# EasyEDA Pro project ProPrj_Pocket bot_2026-03-04.epro

# Schematic Schematic1
Board Name: Board1; Create Date: 2026-03-03; Page Name: P1; Project Name: Pocket bot; Schematic Name: Schematic1; Update Date: 2026-03-04; Company: EasyEDA.com; Page Size: A4; Version: V1.0
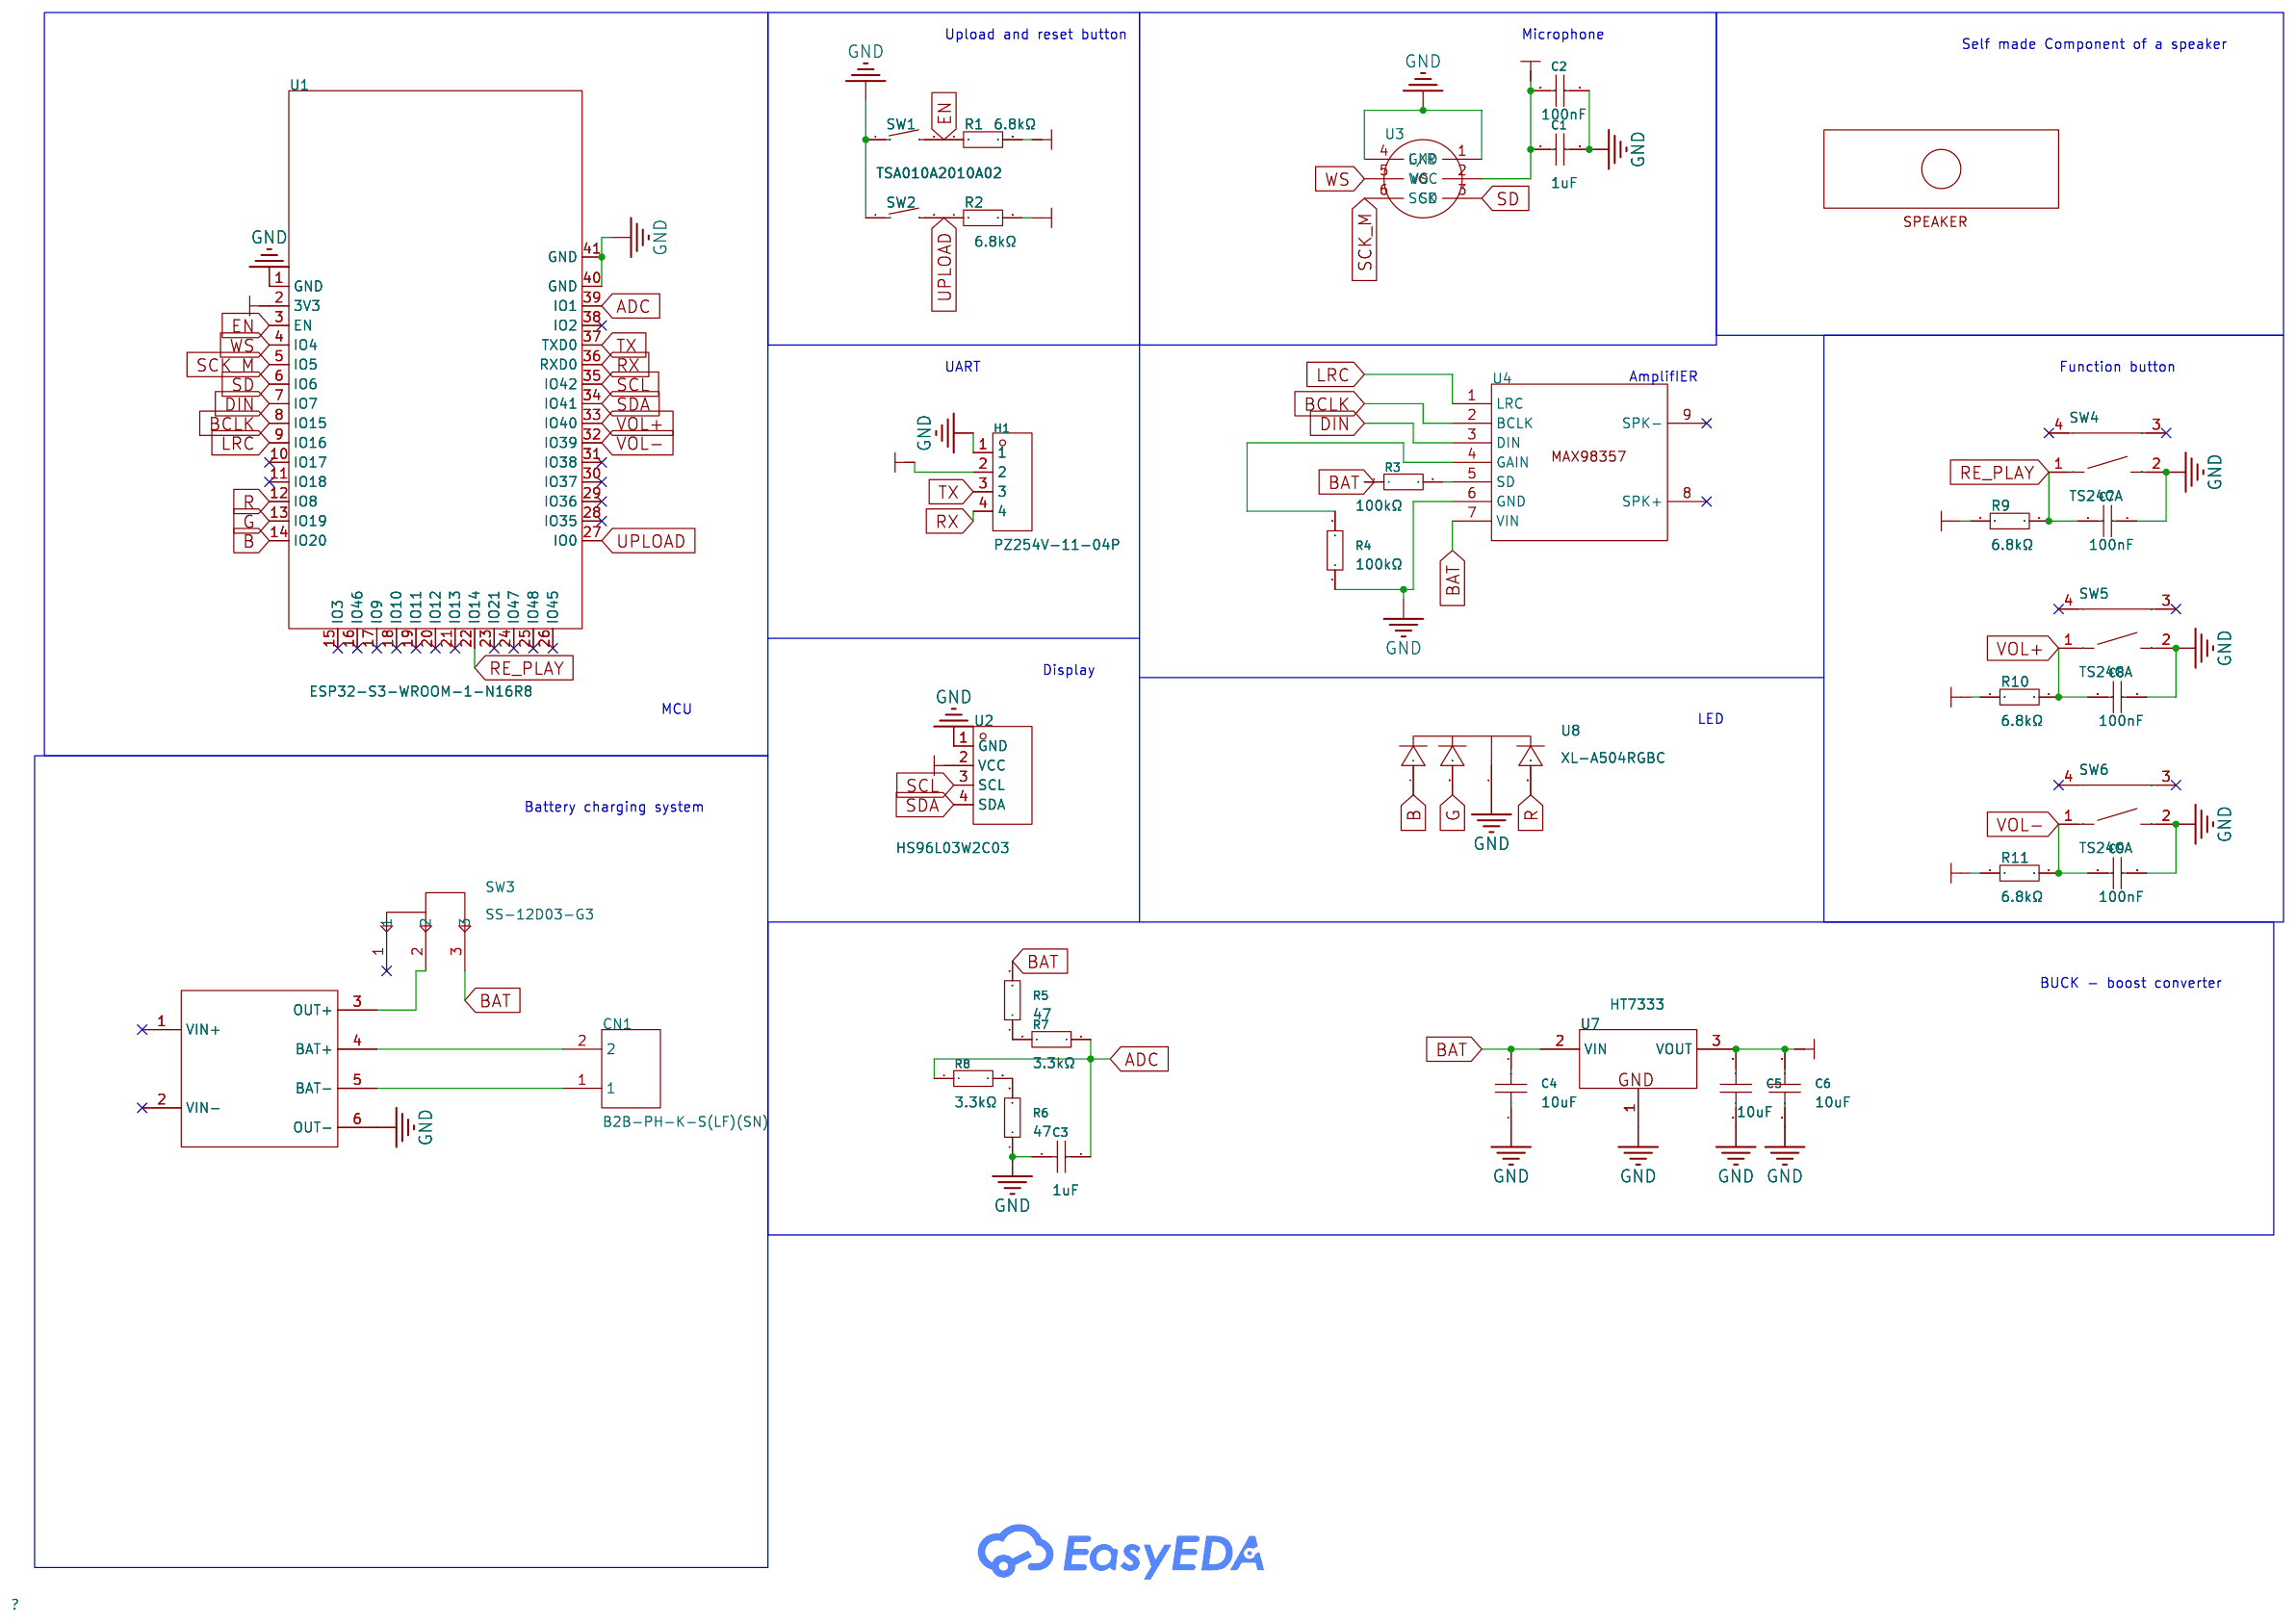
[diagram p0: schematic sheet]

## Parts
C1  1uF  [C0805]
C2  100nF  [C1206]
C3  1uF  [C0805]
C4  10uF  [C0603]
C5  10uF  [C0603]
C6  10uF  [C0603]
C7  100nF  [C1206]
C8  100nF  [C1206]
C9  100nF  [C1206]
CN1  B2B-PH-K-S(LF)(SN)  [CONN-TH_B2B-PH-K-S]
H1  PZ254V-11-04P  [HDR-TH_4P-P2.54-V-M]
R1  6.8kΩ  [R0603]
R2  6.8kΩ  [R0603]
R3  100kΩ  [R0603]
R4  100kΩ  [R0603]
R5  47  [R1206]
R6  47  [R1206]
R7  3.3kΩ  [R0603]
R8  3.3kΩ  [R0603]
R9  6.8kΩ  [R0603]
R10  6.8kΩ  [R0603]
R11  6.8kΩ  [R0603]
SW1  TSA010A2010A02  [KEY-SMD_L3.9-W3.0-LS5.0]
SW2  TSA010A2010A02  [KEY-SMD_L3.9-W3.0-LS5.0]
SW3  SS-12D03-G3  [SW-TH_3P-L8.5-W3.5-P2.50_SS-12D03-G3_C5160828]
SW4  TS24CA  [SW-SMD_2P-TS24CA]
SW5  TS24CA  [SW-SMD_2P-TS24CA]
SW6  TS24CA  [SW-SMD_2P-TS24CA]
U1  ESP32-S3-WROOM-1-N16R8  [WIRELM-SMD_ESP32-S3-WROOM-1]
U2  HS96L03W2C03  [OLED-TH_L27.8-W27.2-P2.54_C9900033791]
U3  -  [INMP441]
U4  -  [MAX98357]
U5  -  [SPEAKER]
U6  -  [TP4056 Carging Module]
U7  HT7333  [SOT-89-3_L4.5-W2.5-P1.50-LS4.1-BR]
U8  XL-A504RGBC  [LED-TH_4P-BD5.8-P1.25_DM-50346EH-73826CC-05RGB-BML60-D]

## Library data of the parts
C1 C3 = CL21B105KBFNNNE: Capacitance:1uF Tolerance:±10% Tolerance:±10% Voltage Rating:50V Temperature Coefficient:X7R; LCSC Part Name: 1uF ±10% 50V; Supplier Part: C28323; Manufacturer: SAMSUNG(三星); Supplier Footprint: 0805; JLCPCB Part Class: Basic Part; Datasheet: https://item.szlcsc.com/datasheet/CL21B105KBFNNNE/29074.html; Supplier: LCSC; Tolerance: ±10%; Voltage Rating: 50V; Temperature Coefficient: X7R
C2 C7-C9 = CL31B104KBCNNNC: Capacitance:100nF Tolerance:±10% Tolerance:±10% Voltage Rating:50V Temperature Coefficient:X7R; LCSC Part Name: 100nF ±10% 50V; Supplier Part: C24497; Manufacturer: SAMSUNG(三星); Supplier Footprint: 1206; JLCPCB Part Class: Basic Part; Datasheet: https://item.szlcsc.com/datasheet/CL31B104KBCNNNC/25237.html; Supplier: LCSC; Tolerance: ±10%; Voltage Rating: 50V; Temperature Coefficient: X7R
C4-C6 = CL10A106MA8NRNC: Capacitance:10uF Tolerance:±20% Tolerance:±20% Voltage Rating:25V Temperature Coefficient:X5R; LCSC Part Name: 10uF ±20% 25V; Supplier Part: C96446; Manufacturer: SAMSUNG(三星); Supplier Footprint: 0603; JLCPCB Part Class: Basic Part; Datasheet: https://item.szlcsc.com/datasheet/CL10A106MA8NRNC/97651.html; Supplier: LCSC; Tolerance: ±20%; Voltage Rating: 25V; Temperature Coefficient: X5R
CN1 = B2B-PH-K-S(LF)(SN): Pins Structure:1x2P Pitch:2mm Mounting Type:Through Hole Reference Series:PH Number of Pins:2P Number of Rows:1 Number of PINs Per Row:2 Row Spacing:- Current Rating:2A Contact Material:Brass Contact Plating:Tin Operating Temperature:-25℃~+85℃ Operating T; LCSC Part Name: 1x2P 间距:2mm 直插 系列:PH; Supplier Part: C131337; Manufacturer: JST; Supplier Footprint: 插件,P=2mm; JLCPCB Part Class: Extended Part; Datasheet: https://item.szlcsc.com/datasheet/B2B-PH-K-S(LF)(SN)/142630.html; Supplier: LCSC; Pins Structure: 1x2P; Pitch: 2mm; Mounting Type: Through Hole; Reference Series: PH; Number of Pins: 2P; Number of Rows: 1; Number of PINs Per Row: 2; Current Rating: 2A; Contact Material: Brass; Contact Plating: Tin; Operating Temperature: -25℃~+85℃; Voltage Rating: 100V; Plastic Material: PA66; Flame Retardant Rating: UL94V-0; Supplementary Features: K Pin; Color: White; Z-Height of the Board: 6mm; X-Length of Bottom Edge on Board (Spacing Line): 5.9mm; Y-Width of Bottom Edge on Board: 4.5mm
H1 = PZ254V-11-04P: Pin Structure:1x4P Pitch:2.54mm Row Spacing:- Circluar Pins/Square Pins:Pin Header Mounting Type:Through Hole Number of Rows:1 Number of Pins:4P Current Rating:3A Voltage Rating (Max):250V Length of Mating Pin:6mm Insulation Height:2.5mm Length of End Con; LCSC Part Name: 1x4P 间距:2.54mm 方针 直插; Supplier Part: C2691448; Manufacturer: XFCN(兴飞); Supplier Footprint: 插件,P=2.54mm; JLCPCB Part Class: Extended Part; Datasheet: https://item.szlcsc.com/datasheet/PZ254V-11-04P/2801085.html; Supplier: LCSC; Pin Structure: 1x4P; Pitch: 2.54mm; Circluar Pins/Square Pins: Pin Header; Mounting Type: Through Hole; Number of Rows: 1; Number of Pins: 4P; Current Rating: 3A; Voltage Rating (Max): 250V; Length of Mating Pin: 6mm; Insulation Height: 2.5mm; Length of End Connection Pin: 3mm; Operating Temperature: -40℃~+105℃; Color: Black
R1 R2 R9-R11 = RC0603FR-071KL: Type:Thick Film Resistor Resistance:1kΩ Tolerance:±1% Tolerance:±1% Power(Watts):100mW Voltage-Supply(Max):75V Temperature Coefficient:±100ppm/℃ Temperature Coefficient:±100ppm/℃ Operating Temperature:-55℃~+155℃ Operating Temperature:-55℃~+155℃; LCSC Part Name: 厚膜电阻 1kΩ ±1% 100mW; Supplier Part: C22548; Manufacturer: YAGEO(国巨); Supplier Footprint: 0603; JLCPCB Part Class: Extended Part; Datasheet: https://item.szlcsc.com/datasheet/RC0603FR-071KL/23274.html; Supplier: LCSC; Type: Thick Film Resistor; Tolerance: ±1%; Power(Watts): 100mW; Voltage-Supply(Max): 75V; Temperature Coefficient: ±100ppm/℃; Operating Temperature: -55℃~+155℃
R3 R4 = RC0603FR-07100KL: Type:Thick Film Resistors Resistance: Tolerance:±1% Tolerance:±1% Power(Watts): Overload Voltage (Max): Temperature Coefficient:±100ppm/℃ Temperature Coefficient:±100ppm/℃ Operating Temperature Range:-55℃~+155℃ Operating Temperature Range:-55℃~+155℃; LCSC Part Name: 厚膜电阻 100kΩ ±1% 100mW; Supplier Part: C14675; Manufacturer: YAGEO(国巨); Supplier Footprint: 0603; JLCPCB Part Class: Extended Part; Datasheet: https://atta.szlcsc.com/upload/public/pdf/source/20140324/1457707028752.pdf; Supplier: LCSC; Type: Thick Film Resistors; Tolerance: ±1%; Temperature Coefficient: ±100ppm/℃; Operating Temperature Range: -55℃~+155℃
R5 R6 = 1206W4F100KT5E: Type:Thick Film Resistor Resistance:1Ω Tolerance:±1% Tolerance:±1% Power(Watts):250mW Voltage-Supply(Max):200V Temperature Coefficient:±200ppm/℃ Temperature Coefficient:±200ppm/℃ Operating Temperature:-55℃~+155℃ Operating Temperature:-55℃~+155℃; LCSC Part Name: 1Ω ±1% 250mW 厚膜电阻; Supplier Part: C17928; Manufacturer: UNI-ROYAL(厚声); Supplier Footprint: 1206; JLCPCB Part Class: Basic Part; Datasheet: https://item.szlcsc.com/datasheet/1206W4F100KT5E/18616.html; Supplier: LCSC; Type: Thick Film Resistor; Tolerance: ±1%; Power(Watts): 250mW; Voltage-Supply(Max): 200V; Temperature Coefficient: ±200ppm/℃; Operating Temperature: -55℃~+155℃
R7 R8 = 0603WAF3301T5E: Type:Thick Film Resistor Resistance:3.3kΩ Tolerance:±1% Tolerance:±1% Power(Watts):100mW Voltage-Supply(Max):75V Temperature Coefficient:±100ppm/℃ Temperature Coefficient:±100ppm/℃ Operating Temperature:-55℃~+155℃ Operating Temperature:-55℃~+155℃; LCSC Part Name: 3.3kΩ ±1% 100mW 厚膜电阻; Supplier Part: C22978; Manufacturer: UNI-ROYAL(厚声); Supplier Footprint: 0603; JLCPCB Part Class: Basic Part; Datasheet: https://item.szlcsc.com/datasheet/0603WAF3301T5E/23705.html; Supplier: LCSC; Type: Thick Film Resistor; Tolerance: ±1%; Power(Watts): 100mW; Voltage-Supply(Max): 75V; Temperature Coefficient: ±100ppm/℃; Operating Temperature: -55℃~+155℃
SW1 SW2 = TSA010A2010A02: Actuator Style:Round Button Operating Force:1N Mounting Type:Surface Mount,Vertical Length:3.9mm Width:3mm Switch Height:2mm Contact Current:50mA Voltage Rating:12V Life:-; LCSC Part Name: 3*4*2.0H-J 100gf 单弹平脚; Supplier Part: C2888943; Manufacturer: BZCN(博众电气); Supplier Footprint: SMD,3.9x3mm; JLCPCB Part Class: Extended Part; Datasheet: https://item.szlcsc.com/datasheet/TSA010A2010A02/3109346.html; Supplier: LCSC; Actuator Style: Round Button; Operating Force: 1N; Mounting Type: Surface Mount,Vertical; Length: 3.9mm; Width: 3mm; Switch Height: 2mm; Contact Current: 50mA; Voltage Rating: 12V
SW3 = SS-12D03-G3_C5160828: Supplier Part: C5160828; Manufacturer: DEALON(德艺隆); Supplier Footprint: 插件; JLCPCB Part Class: Extended Part; Datasheet: https://atta.szlcsc.com/upload/public/pdf/source/20220914/46967EFD64D75927271155BD7ED48D9B.pdf; Supplier: LCSC
SW4-SW6 = TS24CA: Circuit:SPST Actuator Style:Rectangular Button Mounting Type:Surface Mount, Right Angle Length:4.55mm Width:1.8mm Switch Height:3.5mm Contact Current:50mA Voltage Rating:12V With Lamp:- Life:-; LCSC Part Name: 4.55*1.8*3.5mm 卧贴 轻触开关; Supplier Part: C393942; Manufacturer: SHOU HAN(首韩); Supplier Footprint: SMD,4.6x1.8mm; JLCPCB Part Class: Extended Part; Datasheet: https://item.szlcsc.com/datasheet/TS24CA/372554.html; Supplier: LCSC; Circuit: SPST; Actuator Style: Rectangular Button; Mounting Type: Surface Mount, Right Angle; Length: 4.55mm; Width: 1.8mm; Switch Height: 3.5mm; Contact Current: 50mA; Voltage Rating: 12V
U1 = ESP32-S3-WROOM-1-N16R8: LCSC Part Name: 通用型Wi-Fi+低功耗蓝牙MCU模组; Supplier Part: C2913202; Manufacturer: ESPRESSIF(乐鑫); Supplier Footprint: SMD,25.5x18mm; JLCPCB Part Class: Extended Part; Datasheet: https://item.szlcsc.com/datasheet/ESP32-S3-WROOM-1-N16R8/3198300.html; Supplier: LCSC
U2 = HS96L03W2C03: Controller Type:SSD1315 chip Interface:I2C Size:0.96 Dot Pixels:128x64 Operating Temperature:-40℃~+70℃ Operating Temperature:-40℃~+70℃ Type of Drive:Passive (PMOLED) Display Range:21.744x10.864mm Display Color:White Voltage - Supply:2.8V~3.3V Voltage - Su; LCSC Part Name: 0.96寸OLED显示屏窄白光IIC; Supplier Part: C5248080; Manufacturer: HS(汉昇); JLCPCB Part Class: Extended Part; Datasheet: https://item.szlcsc.com/datasheet/HS96L03W2C03/5960631.html; Supplier: LCSC; Controller Type: SSD1315 chip; Interface: I2C; Size: 0.96; Dot Pixels: 128x64; Operating Temperature: -40℃~+70℃; Type of Drive: Passive (PMOLED); Display Range: 21.744x10.864mm; Display Color: White; Voltage - Supply: 2.8V~3.3V; Luminance: 180cd/m2
U3 = INMP441
U4 = MAX98357
U5 = SPEAKER
U6 = TP4056 Charging Module
U7 = HT7333: Output Type:-; Supplier Part: C259241; Supplier Footprint: SOT-89-3; JLCPCB Part Class: Extended Part; Supplier: LCSC
U8 = XL-A504RGBC: Diode Configuration:Common Cathode Lens Color:Colorless Transparent Lens Operating Temperature:-30℃~+85℃ Operating Temperature:-30℃~+85℃; Supplier Part: C7371894; Manufacturer: XINGLIGHT(成兴光); Supplier Footprint: 插件,D=5mm; JLCPCB Part Class: Extended Part; Datasheet: https://item.szlcsc.com/datasheet/XL-A504RGBC/8342966.html; Supplier: LCSC; Diode Configuration: Common Cathode; Lens Color: Colorless Transparent Lens; Operating Temperature: -30℃~+85℃

## Nets
+3V3: C1.1 C2.1 C5.2 C6.2 H1.2 R1.2 R2.2 R9.2 R10.2 R11.2 U1.2(3V3) U2.2(VCC) U3.2(VCC) U7.3(VOUT)
GND: C1.2 C2.2 C3.1 C4.1 C5.1 C6.1 C7.2 C8.2 C9.2 H1.1 R4.1 R6.1 SW1.1 SW2.1 SW4.2 SW5.2 SW6.2 U1.1(GND) U1.40(GND) U1.41(GND) U2.1(GND) U3.1(GND) U3.4(L/R) U4.6(GND) U6.6(OUT-) U7.1(GND) U8.1(-)
ADC: C3.2 R7.2 R8.1 U1.39(IO1)
B: U1.14(IO20) U8.4
BAT: C4.2 R3.1 R5.2 SW3.3 U4.7(VIN) U7.2(VIN)
BCLK: U1.8(IO15) U4.2(BCLK)
DIN: U1.7(IO7) U4.3(DIN)
EN: R1.1 SW1.2 U1.3(EN)
G: U1.13(IO19) U8.3
LRC: U1.9(IO16) U4.1(LRC)
R: U1.12(IO8) U8.2
RE_PLAY: C7.1 R9.1 SW4.1 U1.22(IO14)
RX: H1.4 U1.36(RXD0)
SCK_M: U1.5(IO5) U3.6(SCK)
SCL: U1.35(IO42) U2.3(SCL)
SD: U1.6(IO6) U3.3(SD)
SDA: U1.34(IO41) U2.4(SDA)
TX: H1.3 U1.37(TXD0)
UPLOAD: R2.1 SW2.2 U1.27(IO0)
VOL+: C8.1 R10.1 SW5.1 U1.33(IO40)
VOL-: C9.1 R11.1 SW6.1 U1.32(IO39)
WS: U1.4(IO4) U3.5(WS)
$1N2533: R3.2 U4.5(SD)
$1N2537: R4.2 U4.4(GAIN)
$1N4097: SW3.2 U6.3(OUT+)
$1N4270: CN1.2 U6.4(BAT+)
$1N4274: CN1.1 U6.5(BAT-)
$1N4477: R5.1 R7.1
$1N4516: R6.2 R8.2

Not connected (* = marked no-connect by the designer): SW3 1*; SW4 3* 4*; SW5 3* 4*; SW6 3* 4*; U1 10(IO17)* 11(IO18)* 15(IO3)* 16(IO46)* 17(IO9)* 18(IO10)* 19(IO11)* 20(IO12)* 21(IO13)* 23(IO21)* 24(IO47)* 25(IO48)* 26(IO45)* 28(IO35)* 29(IO36)* 30(IO37)* 31(IO38)* 38(IO2)*; U4 8(SPK+)* 9(SPK-)*; U6 1(VIN+)* 2(VIN-)*

## Notes on the sheet
- Upload and reset button
- Microphone
- Self made Component of a speaker
- UART
- AmplifIER
- Function button
- Display
- MCU
- LED
- Battery charging system
- BUCK - boost converter

# Board PCB1
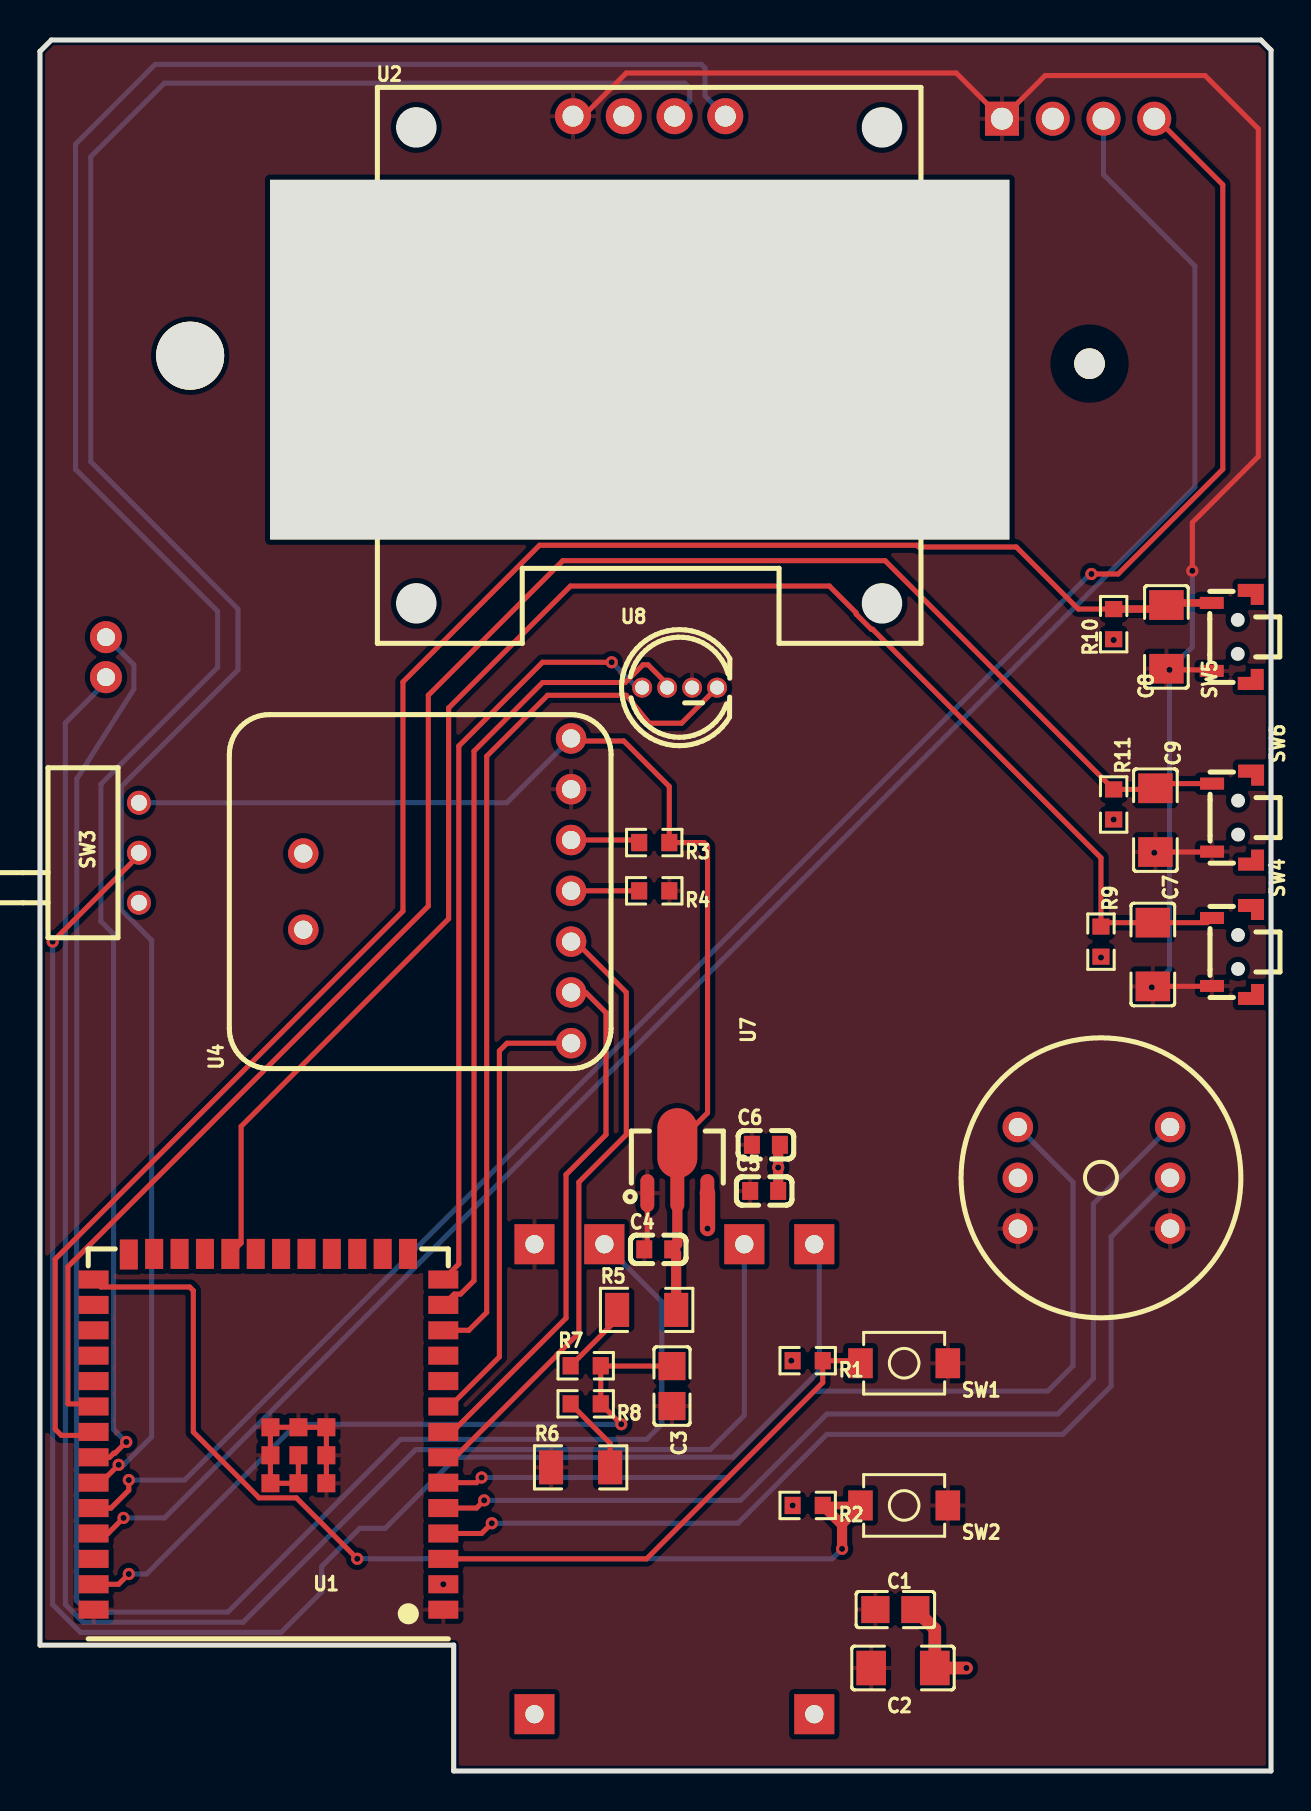
[diagram p1: board, top side]
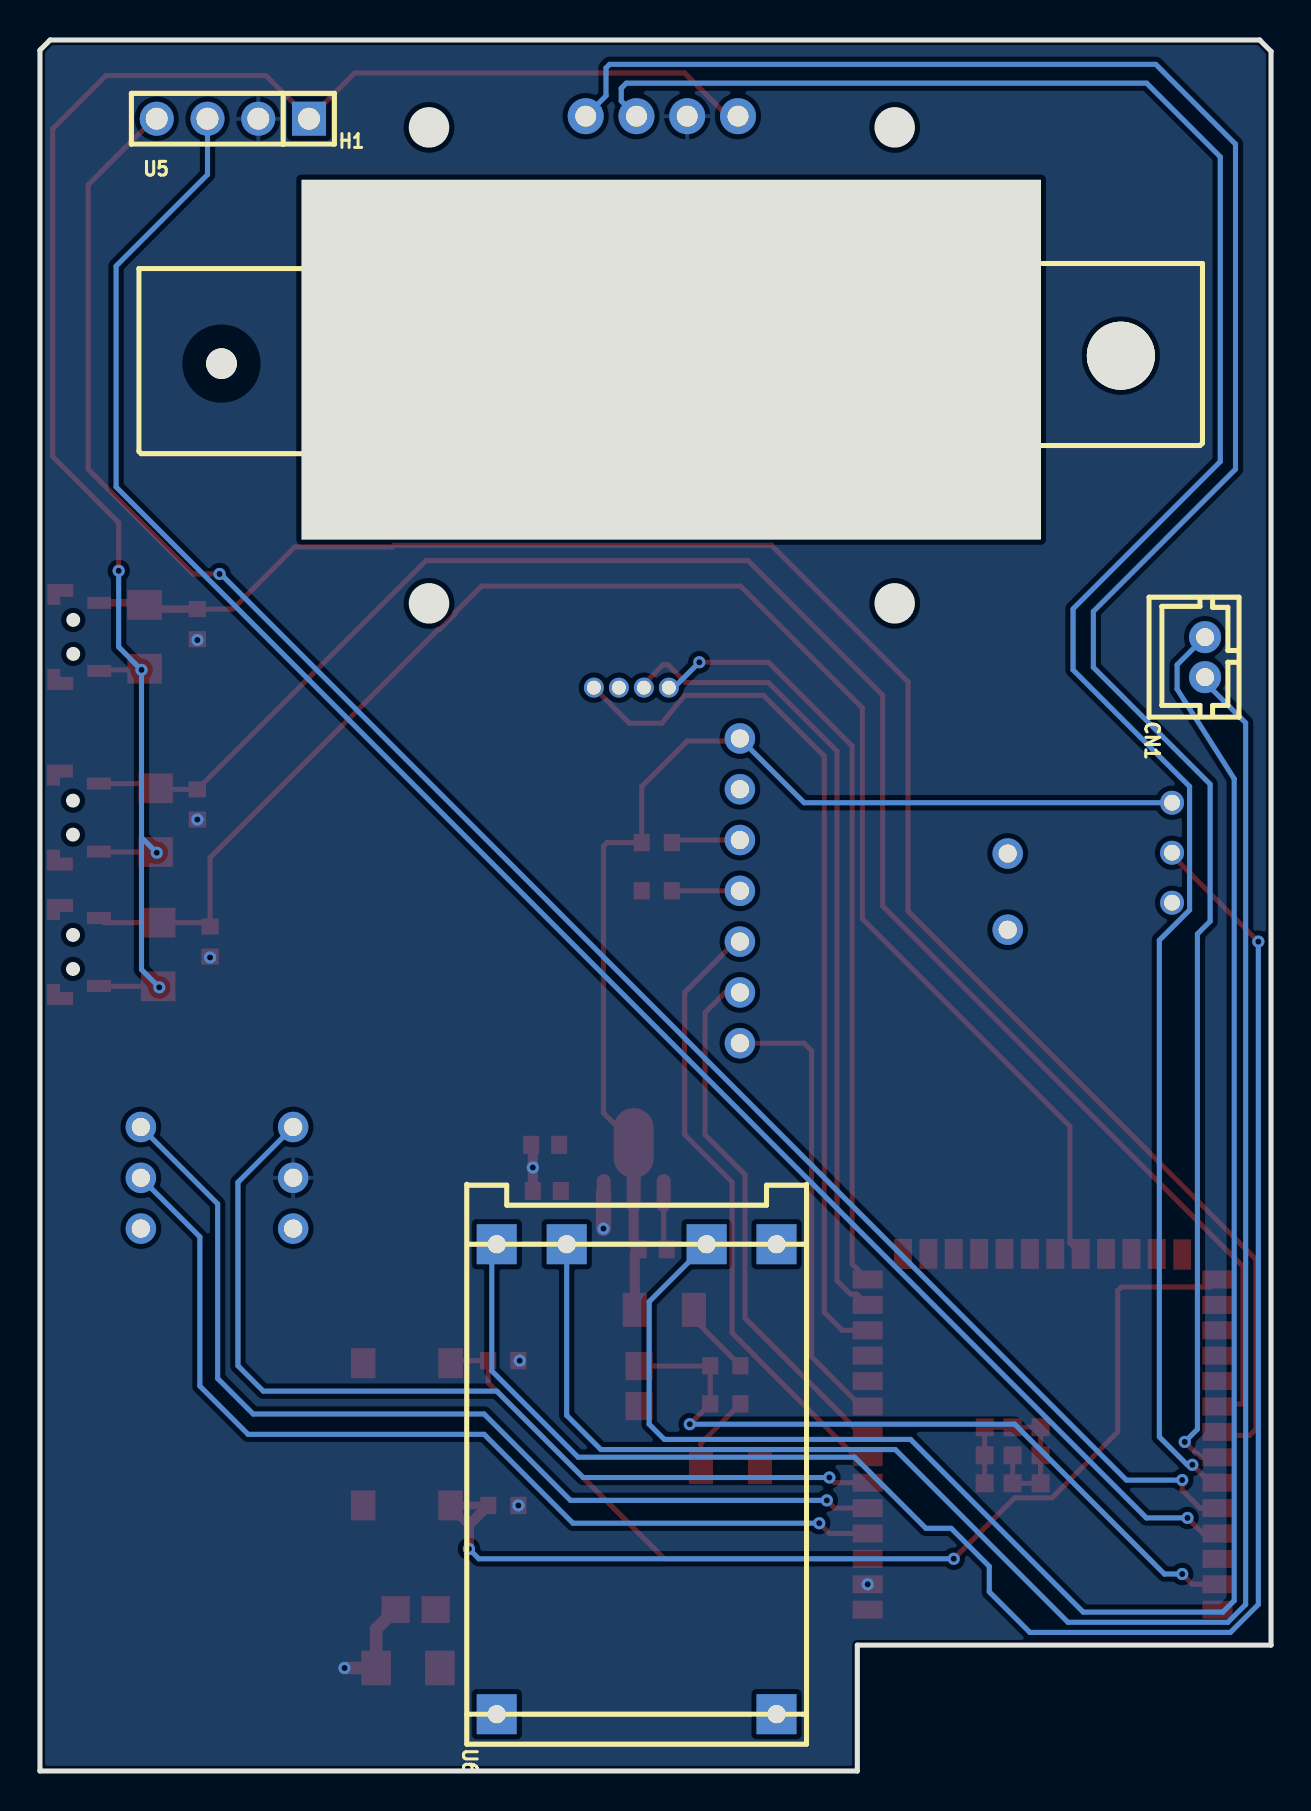
[diagram p2: board, bottom side, seen from below]

Outline 61.59 x 86.56 mm; copper layers: Top Layer, Bottom Layer. Coordinates in mm from the lower left corner of the outline.
Outline path: 0,85.99 0.57,86.56 61.09,86.56 61.59,86.05 61.59,0 20.7,0 20.7,6.29 0,6.29 0,85.99
Stack: Top Layer 0.035mm / Dielectric1 1.51mm FR4 er 4.5 / Bottom Layer 0.035mm

## Design rules (mm)
template: JLCPCB Capability(Two Layers Board)
spacing copperThickness1oz (default): track to track 0.102, other pairs 0.152 to 0.3
spacing copperThickness2oz: track to track 0.203, other pairs 0.152 to 0.3
track width copperThickness1oz (default): min 0.127, default 0.254, max 2.54
track width copperThickness2oz: min 0.203, default 0.254, max 2.54
differential pair differentialPair (default): width min 0.127, default 0.254, max 2.54; gap min 0.152, default 0.152
via viaSize (default): diameter min 0.5, default 0.61, max 10; hole min 0.3, default 0.305, max 6.3

## Placement (name value [footprint] x y rotation side)
C1  1uF  [C0805]  42.8 8.07 180 top
C2  100nF  [C1206]  43.18 5.15 180 top
C3  1uF  [C0805]  31.62 19.25 90 top
C4  10uF  [C0603]  30.93 26.08 0 top
C5  10uF  [C0603]  36.24 29 0 top
C6  10uF  [C0603]  36.32 31.31 0 top
C7  100nF  [C1206]  55.68 40.83 270 top
C8  100nF  [C1206]  56.36 56.71 270 top
C9  100nF  [C1206]  55.81 47.55 270 top
CN1  B2B-PH-K-S(LF)(SN)  [CONN-TH_B2B-PH-K-S]  3.3 55.7 90 bottom
H1  PZ254V-11-04P  [HDR-TH_4P-P2.54-V-M]  51.94 82.62 0 bottom
R1  6.8kΩ  [R0603]  38.41 20.52 180 top
R2  6.8kΩ  [R0603]  38.41 13.28 180 top
R3  100kΩ  [R0603]  30.73 46.43 180 top
R4  100kΩ  [R0603]  30.73 44.01 180 top
R5  47  [R1206]  30.35 23.06 0 top
R6  47  [R1206]  27.05 15.18 0 top
R7  3.3kΩ  [R0603]  27.31 20.26 0 top
R8  3.3kΩ  [R0603]  27.31 18.36 180 top
R9  6.8kΩ  [R0603]  53.09 41.47 270 top
R10  6.8kΩ  [R0603]  53.72 57.35 270 top
R11  6.8kΩ  [R0603]  53.72 48.33 270 top
SW1  TSA010A2010A02  [KEY-SMD_L3.9-W3.0-LS5.0]  43.24 20.39 180 top
SW2  TSA010A2010A02  [KEY-SMD_L3.9-W3.0-LS5.0]  43.24 13.28 180 top
SW3  SS-12D03-G3  [SW-TH_3P-L8.5-W3.5-P2.50_SS-12D03-G3_C5160828]  4.95 45.92 90 top
SW4  TS24CA  [SW-SMD_2P-TS24CA]  59.62 40.96 270 top
SW5  TS24CA  [SW-SMD_2P-TS24CA]  59.6 56.71 270 top
SW6  TS24CA  [SW-SMD_2P-TS24CA]  59.62 47.67 270 top
U1  ESP32-S3-WROOM-1-N16R8  [WIRELM-SMD_ESP32-S3-WROOM-1]  11.43 16.96 180 top
U2  HS96L03W2C03  [OLED-TH_L27.8-W27.2-P2.54_C9900033791]  30.48 82.75 0 top
U3  -  [INMP441]  53.09 29.66 90 top
U4  -  [MAX98357]  28.57 35.12 90 top
U5  -  [SPEAKER]  55.75 60.65 180 bottom
U6  -  [TP4056 Carging Module]  23.24 1.34 90 bottom
U7  HT7333  [SOT-89-3_L4.5-W2.5-P1.50-LS4.1-BR]  31.89 30.15 270 top
U8  XL-A504RGBC  [LED-TH_4P-BD5.8-P1.25_DM-50346EH-73826CC-05RGB-BML60-D]  32 54.17 0 top

## Footprints (pads in the part's own frame, mm; a bottom-side part is the same pattern mirrored in y, then rotated)
C0603
  rect 0.8x0.9 smd: 1(-0.7,0) 2(0.7,0)
C0805
  rect 1.41x1.35 smd: 1(-1,0) 2(1,0)
C1206
  rect 1.485x1.728 smd: 1(-1.593,0) 2(1.593,0)
CONN-TH_B2B-PH-K-S
  round 1.6 hole 0.9: 1(1,0) 2(-1,0)
HDR-TH_4P-P2.54-V-M
  rect 1.7x1.7 hole 1.1: 1(-3.81,0)
  round 1.7 hole 1.1: 2(-1.27,0) 3(1.27,0) 4(3.81,0)
INMP441
  round 1.524 hole 0.914: 1(-2.54,4.159) 2(0,4.159) 3(2.54,4.159) 4(-2.54,-3.461) 5(0,-3.461) 6(2.54,-3.461)
KEY-SMD_L3.9-W3.0-LS5.0
  rect 1.23x1.5 smd: 1(-2.185,0) 2(2.185,0)
LED-TH_4P-BD5.8-P1.25_DM-50346EH-73826CC-05RGB-BML60-D
  round 1 hole 0.7: 1(0.625,0) 2(1.875,0) 3(-0.625,0) 4(-1.875,0)
MAX98357
  round 1.524 hole 0.914: 1(1.27,2) 2(3.81,2) 3(6.35,2) 4(8.89,2) 5(11.43,2) 6(13.97,2) 7(16.51,2) 8(10.755,15.4) 9(6.945,15.4)
OLED-TH_L27.8-W27.2-P2.54_C9900033791
  round 1.8 hole 1.05: 1(-3.81,0) 2(-1.27,0) 3(1.27,0) 4(3.81,0)
R0603
  rect 0.806x0.864 smd: 1(-0.753,0) 2(0.753,0)
R1206
  rect 1.208x1.701 smd: 1(-1.479,0) 2(1.479,0)
SOT-89-3_L4.5-W2.5-P1.50-LS4.1-BR
  oval 1.9x0.7 smd: 1(1.25,-1.501) 3(1.25,1.501)
  oval 3.5x2 smd: 2(-1.25,0)
  oval 2.1x0.7 smd: 2(1.151,0)
SPEAKER
  round 1.524 hole 3.4: 1(3.24,9.724)
  round 3.4 hole 3.4: 2(48.238,10.122)
SW-SMD_2P-TS24CA
  rect 0.6x1.2 smd: 1(-1.7,-0.975) 2(1.7,-0.975)
  custom 1.05x1.3 smd: 3(2.125,0.975) 4(-2.125,0.975)
SW-TH_3P-L8.5-W3.5-P2.50_SS-12D03-G3_C5160828
  round 1.2 hole 0.8: 1(-2.5,0) 2(0,0) 3(2.5,0)
TP4056 Carging Module
  rect 2x2 hole 0.914: 1(1.5,15.5) 2(1.5,1.5) 3(25,15.5) 4(25,12) 5(25,5) 6(25,1.5)
WIRELM-SMD_ESP32-S3-WROOM-1
  rect 1.5x0.9 smd: 1(-8.75,8.895) 2(-8.75,7.625) 3(-8.75,6.355) 4(-8.75,5.085) 5(-8.75,3.815) 6(-8.75,2.545) 7(-8.75,1.275) 8(-8.75,0.005) 9(-8.75,-1.265) 10(-8.75,-2.535) 11(-8.75,-3.805) 12(-8.75,-5.075) 13(-8.75,-6.345) 14(-8.75,-7.615) 27(8.75,-7.615) 28(8.75,-6.345) 29(8.75,-5.075) 30(8.75,-3.805) 31(8.75,-2.535) 32(8.75,-1.265) 33(8.75,0.005) 34(8.75,1.275) 35(8.75,2.545) 36(8.75,3.815) 37(8.75,5.085) 38(8.75,6.355) 39(8.75,7.625) 40(8.75,8.895)
  rect 0.9x1.5 smd: 15(-6.985,-8.895) 16(-5.715,-8.895) 17(-4.445,-8.895) 18(-3.175,-8.895) 19(-1.905,-8.895) 20(-0.635,-8.895) 21(0.635,-8.895) 22(1.905,-8.895) 23(3.175,-8.895) 24(4.445,-8.895) 25(5.715,-8.895) 26(6.985,-8.865)
  rect 0.9x0.9 smd: 41(-2.9,2.575) 41(-2.9,1.175) 41(-2.9,-0.225) 41(-1.5,2.575) 41(-1.5,1.175) 41(-1.5,-0.225) 41(-0.1,2.575) 41(-0.1,1.175) 41(-0.1,-0.225)

## Nets
As in the schematic.

Pads without a net: SW3 1; SW4 3 4; SW5 3 4; SW6 3 4; U1 10 11 15 16 17 18 19 20 21 23 24 25 26 28 29 30 31 38; U4 8 9; U5 1 2; U6 1 2

## Via types
v1: diameter 0.61, hole 0.305, Top Layer to Bottom Layer, 27 vias

## Routing (per net, layer and track width the routed paths; a pad name or vN(x,y) marks a point on that pad's centre or on a via; arc(x,y) is an arc through that point)
+3V3: length 9.1
  Top Layer w0.508: 37.15,31.31 36.94,31.1 v1(36.94,30.18) C5.2
  Top Layer w0.635: v1(46.35,5.15) C2.1 44.77,7.1 C1.1
  Top Layer w0.762: U7.3 33.4,28.89 v1(33.4,27.12)
  vias: v1(20.18,9.34) v1(37.59,20.52) v1(37.66,13.28) v1(53.09,40.68) v1(53.72,56.55) v1(53.72,47.58)
GND: length 106.5
  Top Layer w0.254: SW4.2 58.62,39.24 C7.2 55.67,39.24 v1(55.63,39.19) ; U2.1 27.18,82.75 29.34,84.91 45.85,84.91 H1.1 50.29,84.78 58.29,84.78 60.96,82.11 60.96,65.73 57.66,62.43 v1(57.66,60.01) ; v1(55.75,45.92) 55.79,45.95 C9.2 58.63,45.95 SW6.2 ; U1.41 U1.41 11.53,14.39 11.53,17.19 U1.41 U1.41 U1.41 U1.41 ; SW5.2 58.58,55.06 v1(56.51,55.06) ; C4.1 30.39,26.24 U7.1
  Bottom Layer w0.254: 56.51,46.68 v1(55.75,45.92) ; 56.51,46.68 56.51,40.08 v1(55.63,39.19) ; 56.51,46.68 v1(56.51,55.06) 57.66,56.2 v1(57.66,60.01)
ADC: length 36.6
  Top Layer w0.254: C3.2 28.07,20.25 R7.2 R8.1 29.07,17.34 v1(29.08,17.34) ; U1.39 3.93,9.34 v1(4.44,9.85)
  Bottom Layer w0.254: v1(4.44,9.85) 5.33,9.85 12.83,17.34 v1(29.08,17.34)
B: length 38.4
  Top Layer w0.254: v1(28.6,55.44) 25.15,55.44 20.95,51.25 20.95,25.35 U1.14
  Bottom Layer w0.254: v1(28.6,55.44) 29.88,54.17 U8.4
BAT: length 55.3
  Top Layer w0.254: 31.89,26.34 C4.2 31.83,25.89 ; U7.2 33.4,32.91 33.4,46.25 33.22,46.43 R3.1 31.49,49.23 29.21,51.51 26.7,51.51 U4.7
  Top Layer w0.508: U7.2 31.89,26.34 ; 31.83,23.06 31.83,25.89
  Bottom Layer w0.254: U4.7 23.36,48.42 SW3.3
BCLK: length 26.8
  Top Layer w0.254: U4.2 27.31,38.93 28.32,37.92 28.32,31.82 26.32,29.82 26.32,22.65 20.81,17.14 20.49,17.14 20.31,16.96 U1.8
DIN: length 31.2
  Top Layer w0.254: U1.7 20.76,15.69 25.87,20.8 25.87,20.81 26.96,21.9 26.96,29.45 29.34,31.82 29.34,38.93 26.8,41.47 U4.3
EN: length 25.7
  Top Layer w0.254: SW1.2 40.93,20.52 39.17,20.52 39.17,19.42 30.35,10.61 U1.3
G: length 40.6
  Top Layer w0.254: U1.13 20.72,23.85 21.05,23.85 21.72,24.52 21.72,51 25.15,54.43 29.28,54.43 30.17,55.32 30.42,55.32 31.38,54.36 U8.3
LRC: length 22.9
  Top Layer w0.254: U1.9 20.5,18.23 22.99,20.71 22.99,36.01 23.37,36.39 U4.1
R: length 44.5
  Top Layer w0.254: U8.2 32.1,52.39 30.48,52.39 29.34,53.79 25.4,53.79 22.35,50.74 22.35,22.93 21.46,22.04 U1.12
RE_PLAY: length 81.8
  Top Layer w0.254: U1.22 10.07,26.4 10.07,32.23 20.45,42.62 20.45,53.16 26.54,59.25 39.5,59.25 40.84,57.91 40.84,57.85 41.59,57.09 41.66,57.09 53.09,45.66 R9.1 53.28,42.42 58.41,42.42 SW4.1
RX: length 97.3
  Top Layer w0.254: U1.36 3.55,13.15 4.44,14.04 v1(4.44,14.55) ; H1.4 55.88,82.62 59.18,79.32 59.18,65.09 53.94,59.86 v1(52.61,59.86)
  Bottom Layer w0.254: v1(52.61,59.86) 52.55,59.86 7.24,14.55 v1(4.44,14.55)
SCK_M: length 49.4
  Top Layer w0.254: v1(22.22,13.53) 21.84,13.15 U1.5
  Bottom Layer w0.254: U3.6 52.7,28.36 52.7,19.63 50.93,17.85 39.37,17.85 35.05,13.53 v1(22.22,13.53)
SCL: length 107.3
  Top Layer w0.254: v1(3.94,15.31) 3.04,14.42 U1.35
  Bottom Layer w0.254: U2.3 32.51,83.51 32.51,84.14 32.26,84.4 6.22,84.4 2.54,80.72 2.54,65.48 9.91,58.11 9.91,55.06 4.07,49.23 4.07,43.05 5.59,41.54 5.59,16.71 4.19,15.31 v1(3.94,15.31)
SD: length 47
  Top Layer w0.254: v1(22.1,14.68) 21.84,14.42 U1.6
  Bottom Layer w0.254: U3.3 51.69,29.44 51.69,20.26 50.42,18.99 38.73,18.99 34.42,14.68 v1(22.1,14.68)
SDA: length 108.8
  Top Layer w0.254: v1(4.32,16.45) 3.76,15.89 3.69,15.89 3.49,15.69 U1.34
  Bottom Layer w0.254: U2.4 33.27,83.76 33.27,85.16 33.09,85.34 5.77,85.34 1.78,81.35 1.78,65.09 8.89,57.98 8.89,55.19 3.05,49.35 3.05,42.49 3.68,41.85 3.68,17.09 v1(4.32,16.45)
TX: length 97.1
  Top Layer w0.254: U1.37 3.4,11.88 v1(4.18,12.66)
  Bottom Layer w0.254: v1(4.18,12.66) 6.23,12.66 57.78,64.21 57.78,75.25 53.21,79.83 H1.3
UPLOAD: length 53.4
  Top Layer w0.254: v1(15.88,10.61) 12.83,13.66 10.96,13.66 7.67,16.95 7.67,24.02 7.49,24.2 3.06,24.2 U1.27
  Top Layer w0.381: 39.17,13.28 SW2.2 41.05,13.18 40.16,12.29
  Top Layer w0.508: v1(40.13,11.11) 40.13,12.31 39.17,13.28
  Bottom Layer w0.254: v1(40.13,11.11) 39.64,10.61 v1(15.88,10.61)
VOL+: length 91.4
  Top Layer w0.254: 56.16,58.1 56.47,58.41 ; R10.1 51.95,58.1 48.85,61.21 43.97,61.21 43.89,61.29 24.99,61.29 18.16,54.46 18.16,43 0.76,25.6 0.76,17.09 1.07,16.78 2.51,16.78 U1.33
  Top Layer w0.381: SW5.1 56.47,58.41 ; R10.1 56.16,58.1
VOL-: length 91.2
  Top Layer w0.254: U1.32 2.55,18.36 1.42,18.36 1.4,18.38 1.4,25.22 19.43,43.25 19.43,53.79 26.16,60.52 42.28,60.52 R11.1 55.76,49.08 C9.1 56.05,49.37 58.77,49.37
WS: length 48.1
  Top Layer w0.254: U1.4 22.09,11.88 v1(22.61,12.39)
  Bottom Layer w0.254: U3.5 53.59,26.71 53.59,19.25 51.18,16.83 39.37,16.83 34.92,12.39 v1(22.61,12.39)
$1N2533: length 3.5
  Top Layer w0.254: 26.57,46.55 29.85,46.55 R3.2
$1N2537: length 3.4
  Top Layer w0.254: U4.4 R4.2
$1N4097: length 90.9
  Top Layer w0.254: v1(0.63,41.47) 4.95,45.79 SW3.2
  Bottom Layer w0.254: v1(0.63,41.47) 0.63,8.33 2.03,6.93 12.06,6.93 14.1,8.96 14.1,10.23 16,12.14 17.27,12.14 20.83,15.69 34.67,15.69 38.99,20.01 38.99,26.09 U6.3
$1N4270: length 94.4
  Bottom Layer w0.254: U6.4 35.24,17.79 33.53,16.07 18.8,16.07 10.16,7.44 2.16,7.44 1.27,8.33 1.27,52.41 3.3,54.44 CN1.2
$1N4274: length 93.2
  Bottom Layer w0.254: U6.5 31.12,23.47 31.12,17.34 30.35,16.58 18.03,16.58 9.4,7.94 2.41,7.94 1.84,8.52 1.84,49.61 4.7,54.1 4.7,55.32 3.32,56.7 CN1.1
$1N4477: length 3.8
  Top Layer w0.254: R7.1 28.87,22.59 R5.1
$1N4516: length 4
  Top Layer w0.254: R6.2 28.53,16.38 R8.2

## Copper pours and planes (outline as drawn; the poured copper is in the pictures)
+3V3 on Bottom Layer: 0,86.56 61.59,86.56 61.59,0 0,0
GND on Top Layer: 0,86.56 61.59,86.56 61.59,-0.06 0,-0.06
